# Altium schematic sheet SmartCard.SchDoc
size A4; Revision: B.2(PCB.SCH)
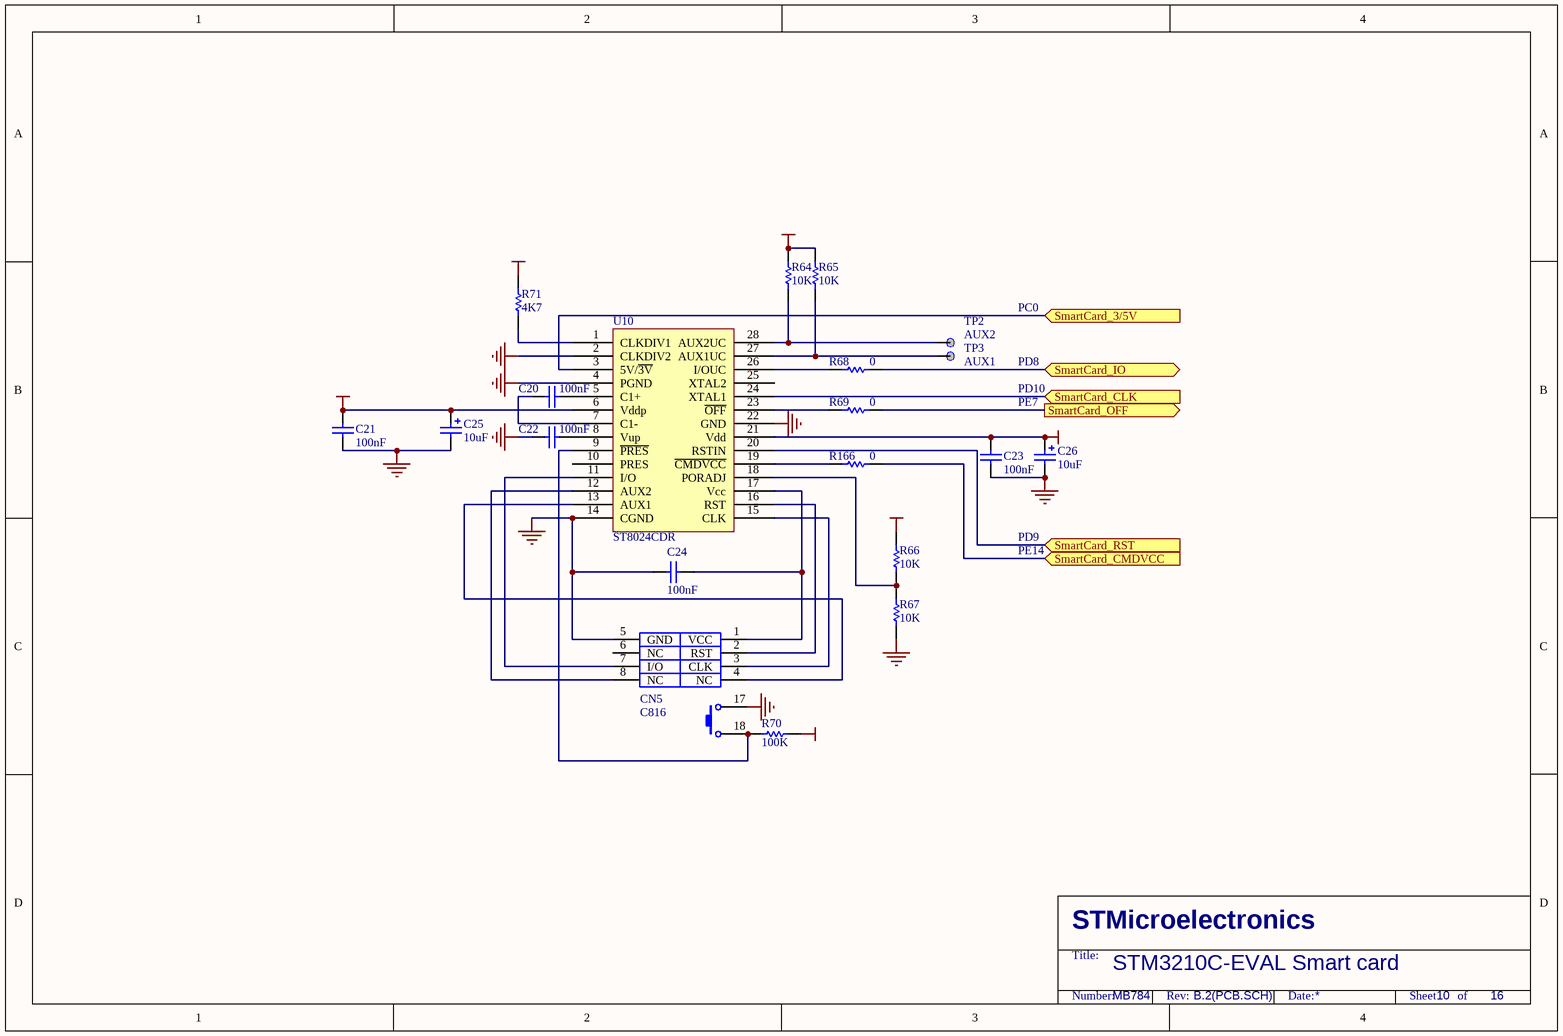
[diagram p0: SmartCard.SchDoc]

## Parts
C20  100nF  [0603C]
C21  100nF  [0603C]
C22  100nF  [0603C]
C23  100nF  [0603C]
C24  100nF  [0603C]
C25  10uF  [TAN-A]
C26  10uF  [TAN-A]
CN5  C816  [SAM(C816)]
R64  10K  [0603R]
R65  10K  [0603R]
R66  10K  [0603R]
R67  10K  [0603R]
R68  0  [0603R]
R69  0  [0603R]
R70  100K  [0603R]
R71  4K7  [0603R]
R166  0  [0603R]
TP2  AUX2  [TP]
TP3  AUX1  [TP]
U10  ST8024CDR  [SO28]

## Ports
SmartCard_3/5V (in), SmartCard_CLK (in), SmartCard_CMDVCC (in), SmartCard_IO (bidir), SmartCard_OFF (out), SmartCard_RST (in)

## Nets
+3V3: C23.1 C26.1 R64.1 R65.1 R66.1 R70.1 R71.1 U10.21(Vdd)
+5V: C21.1 C25.1 U10.6(Vddp)
GND: C21.2 C22.2 C23.2 C24.1 C25.2 C26.2 CN5.5(GND) CN5.17 R67.2 U10.2(CLKDIV2) U10.4(PGND) U10.14(CGND) U10.22(GND)
SmartCard_3/5V: U10.3(5V/~{3V}) ; port SmartCard_3/5V
SmartCard_CLK: U10.24(XTAL1) ; port SmartCard_CLK
SmartCard_CMDVCC: R166.1 ; port SmartCard_CMDVCC
SmartCard_IO: R68.2 ; port SmartCard_IO
SmartCard_OFF: R69.1 ; port SmartCard_OFF
SmartCard_RST: U10.20(RSTIN) ; port SmartCard_RST
NetC20_1: C20.1 U10.7(C1-)
NetC20_2: C20.2 U10.5(C1+)
NetC22_1: C22.1 U10.8(Vup)
NetC24_2: C24.2 CN5.1(VCC) U10.17(Vcc)
NetCN5_2: CN5.2(RST) U10.16(RST)
NetCN5_3: CN5.3(CLK) U10.15(CLK)
NetCN5_4: CN5.4(NC) U10.13(AUX1)
NetCN5_7: CN5.7(I/O) U10.11(I/O)
NetCN5_8: CN5.8(NC) U10.12(AUX2)
NetCN5_18: CN5.18 R70.2 U10.9(~{PRES})
NetR64_2: R64.2 TP2.1 U10.28(AUX2UC)
NetR65_2: R65.2 TP3.1 U10.27(AUX1UC)
NetR66_2: R66.2 R67.1 U10.18(PORADJ)
NetR68_1: R68.1 U10.26(I/OUC)
NetR69_2: R69.2 U10.23(~{OFF})
NetR71_2: R71.2 U10.1(CLKDIV1)
NetR166_2: R166.2 U10.19(~{CMDVCC})

Not connected (* = marked no-connect by the designer): CN5 6(NC); U10 10(PRES) 25(XTAL2)

## Notes on the sheet
- PC0
- PD8
- PD10
- PE7
- PD9
- PE14
- STM3210C-EVAL Smart card
- MB784
- 10
- 16
- STMicroelectronics
- Title:
- Number:
- Rev:
- Date:
- Sheet       of

## Library data of the parts
C20-C24 = CAP: Capacitor; Published: 8-Jun-2000; Revision: July-2002: Re-released for DXP Platform.; Publisher: Altium Limited; Value: 100nF
C25 C26 = Cap Pol1: Polarized Capacitor (Radial); Value: 100pF; Published: 8-Jun-2000; Revision: July-2002: Re-released for DXP Platform.; Publisher: Altium Limited
CN5 = Smart_card_CN
R64-R71 R166 = Res1: Resistor; Value: 1K; Published: 8-Jun-2000; Revision: July-2002: Re-released for DXP Platform.; Publisher: Altium Limited
TP2 TP3 = TP
U10 = ST8024CTR